# Altium schematic sheet ESS-BoB.SchDoc: ESS-BoB
size A3; DrawnBy: Guy Ovadia; Engineer: Guy Ovadia; Organization: TAMI Hackerspace; DocumentNumber: 1; Revision: REV_NOT_USED; SheetNumber: 1; SheetTotal: 1
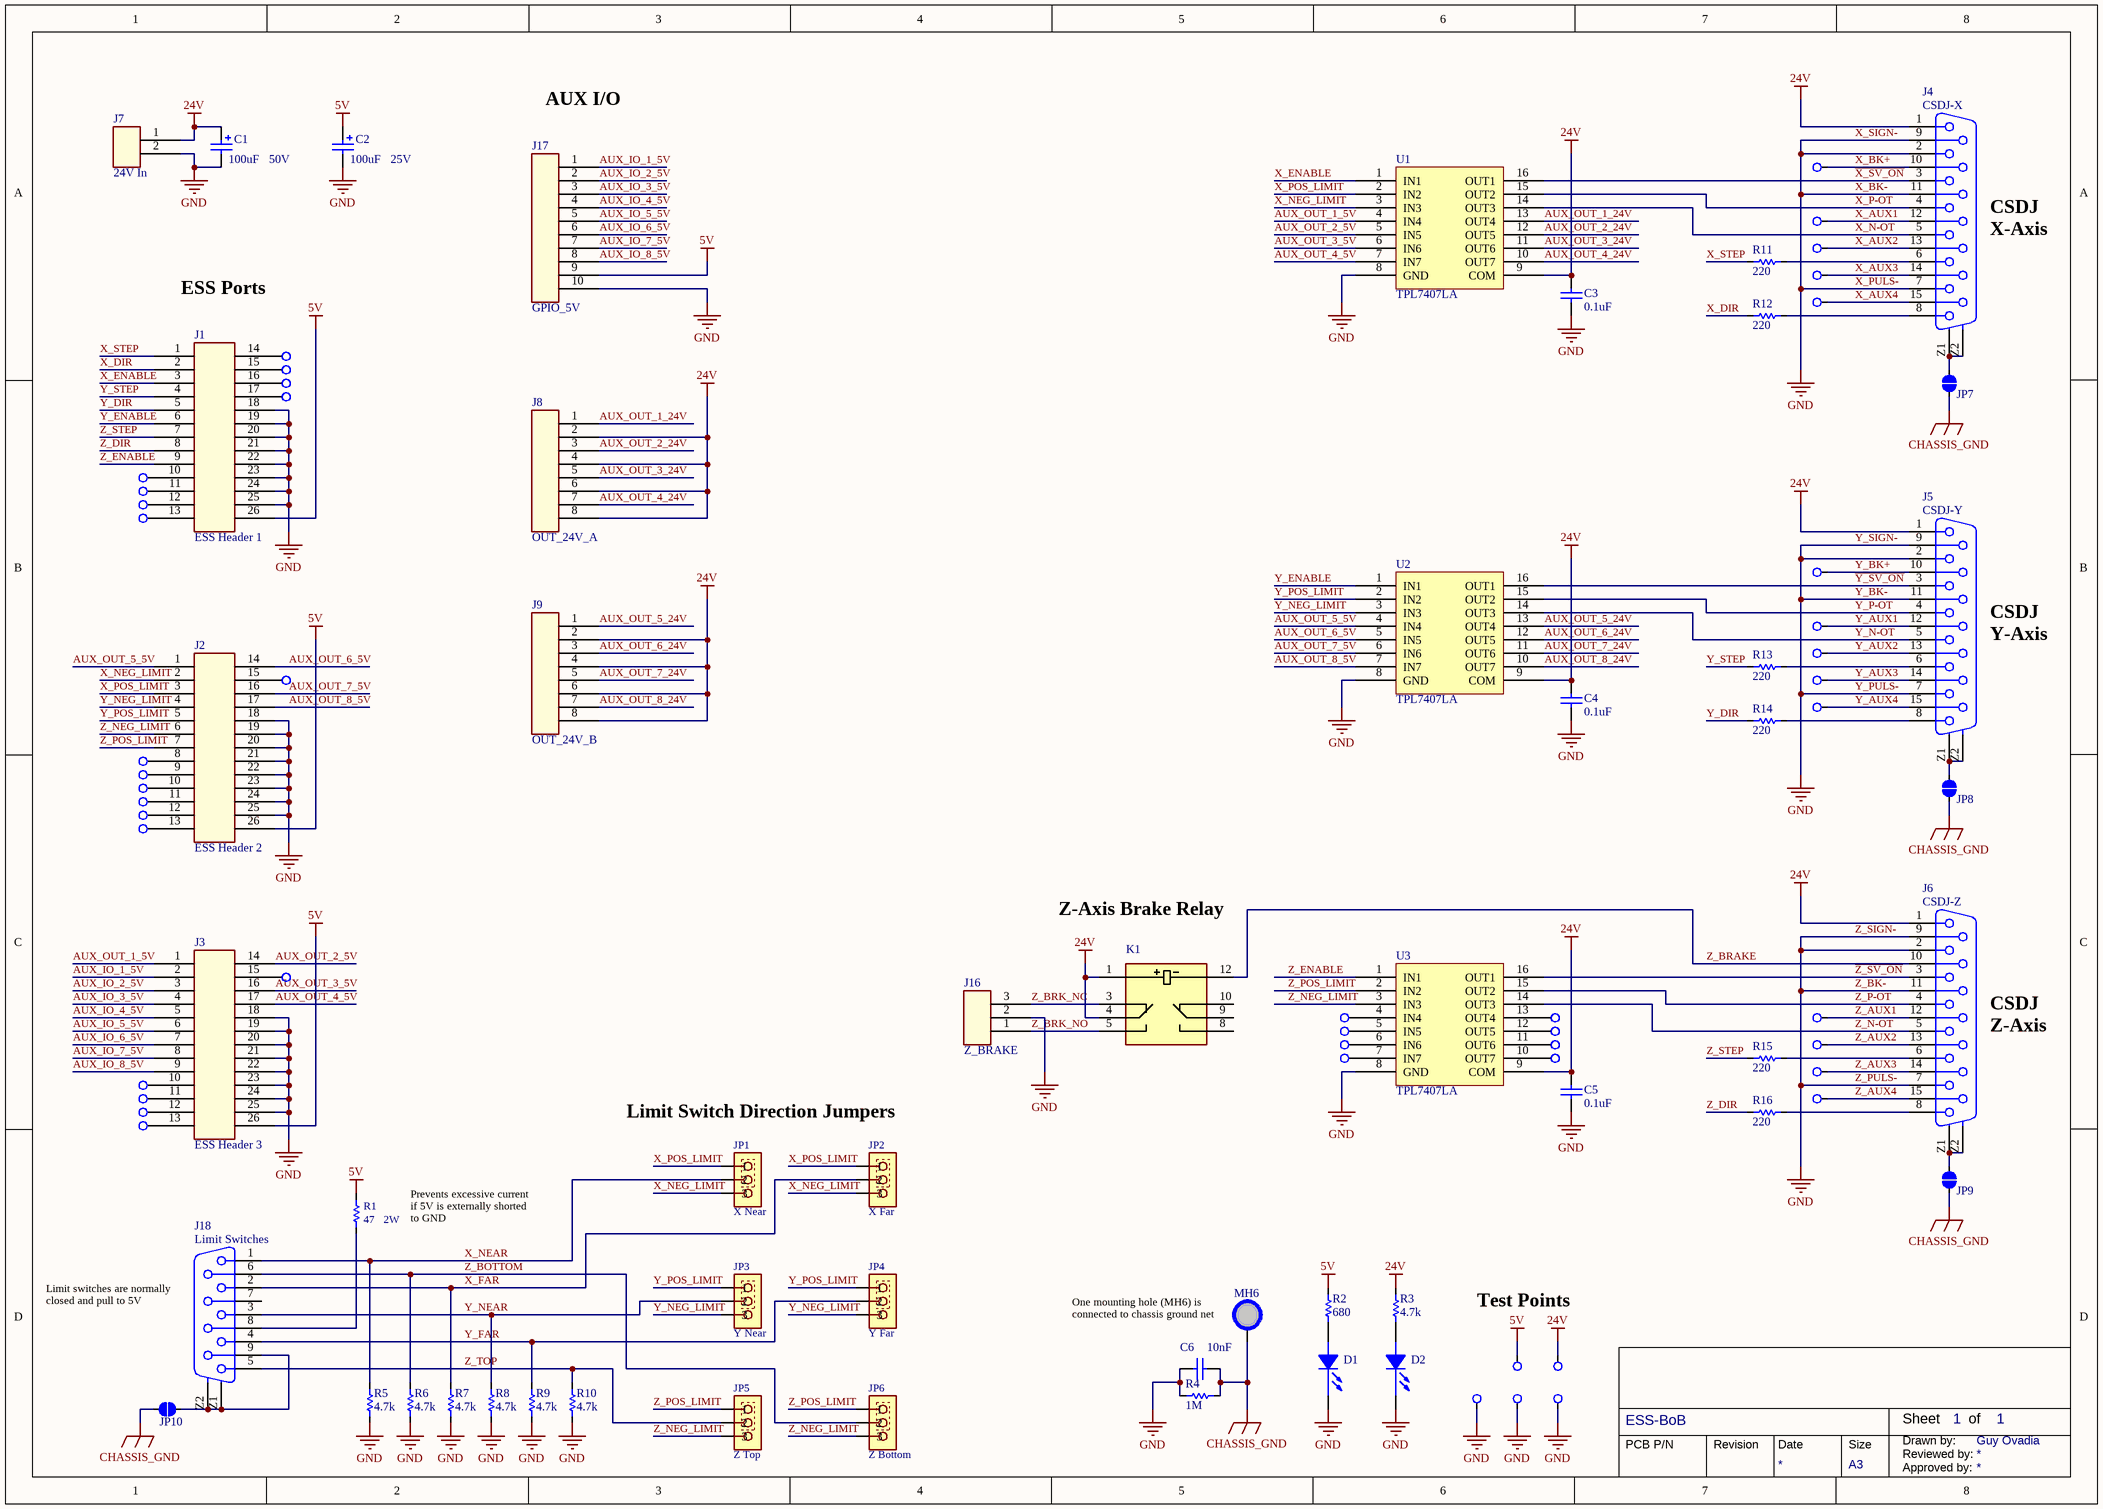
[diagram p0: ESS-BoB.SchDoc]

## Parts
C1  value 100uF  Voltage Rating: 50V  [CAPPR3.5-8x12]  (hidden comment: Cap Polarized)
C2  value 100uF  Voltage Rating: 25V  [CAPPR2-5x11]  (hidden comment: Cap Polarized)
C3  value 0.1uF  [CAPC2012N]  (hidden comment: Cap non-polarized)
C4  value 0.1uF  [CAPC2012N]  (hidden comment: Cap non-polarized)
C5  value 0.1uF  [CAPC2012N]  (hidden comment: Cap non-polarized)
C6  value 10nF  [CAPC2012N]  (hidden comment: Cap non-polarized)
D1  5V  [LED-3MM-RED]  (value not drawn)
D2  24V  [LED-3MM-RED]  (value not drawn)
J1  ESS Header 1  [Samtec ESQ-113-33-G-D]
J2  ESS Header 2  [Samtec ESQ-113-33-G-D]
J3  ESS Header 3  [Samtec ESQ-113-33-G-D]
J4  CSDJ-X  [D-SUB-15 FEMALE TH STRAIGHT]
J5  CSDJ-Y  [D-SUB-15 FEMALE TH STRAIGHT]
J6  CSDJ-Z  [D-SUB-15 FEMALE TH STRAIGHT]
J7  24V In  [Modular Screw Terminals 5.08mm 2p RA TH]
J8  OUT_24V_A  [Modular Screw Terminals 3.5mm 8p RA TH MOLEX]
J9  OUT_24V_B  [Modular Screw Terminals 3.5mm 8p RA TH MOLEX]
J16  Z_BRAKE  [Modular Screw Terminals 3.5mm 3p RA TH MOLEX]
J17  GPIO_5V  [Modular Screw Terminals 3.5mm 10p RA TH MOLEX]
J18  Limit Switches  [D-SUB-9 FEMALE TH RA]
JP1  X Near  [Header 2.54mm 3p TH Vertical]
JP2  X Far  [Header 2.54mm 3p TH Vertical]
JP3  Y Near  [Header 2.54mm 3p TH Vertical]
JP4  Y Far  [Header 2.54mm 3p TH Vertical]
JP5  Z Top  [Header 2.54mm 3p TH Vertical]
JP6  Z Bottom  [Header 2.54mm 3p TH Vertical]
JP7  Solder Jumper NO  [SOLDER JUMPER NO 1.6mm]  (value not drawn)  (no BOM)
JP8  Solder Jumper NO  [SOLDER JUMPER NO 1.6mm]  (value not drawn)  (no BOM)
JP9  Solder Jumper NO  [SOLDER JUMPER NO 1.6mm]  (value not drawn)  (no BOM)
JP10  Solder Jumper NO  [SOLDER JUMPER NO 1.6mm]  (value not drawn)  (no BOM)
K1  V23079A1001B301 _1393788-3_  [TE_RELAY_V23079_TH]  (value not drawn)
MH6  Mounting Hole  [HOLE M4]  (value not drawn)  (no BOM)
R1  value 47  Power (Watts): 2W  [RESC6332N]  (hidden comment: Resistor)
R2  value 680  [RESC2012N]  (hidden comment: Resistor)
R3  value 4.7k  [RESC2012N]  (hidden comment: Resistor)
R4  value 1M  [RESC2012N]  (hidden comment: Resistor)
R5  value 4.7k  [RESC2012N]  (hidden comment: Resistor)
R6  value 4.7k  [RESC2012N]  (hidden comment: Resistor)
R7  value 4.7k  [RESC2012N]  (hidden comment: Resistor)
R8  value 4.7k  [RESC2012N]  (hidden comment: Resistor)
R9  value 4.7k  [RESC2012N]  (hidden comment: Resistor)
R10  value 4.7k  [RESC2012N]  (hidden comment: Resistor)
R11  value 220  [RESC2012N]  (hidden comment: Resistor)
R12  value 220  [RESC2012N]  (hidden comment: Resistor)
R13  value 220  [RESC2012N]  (hidden comment: Resistor)
R14  value 220  [RESC2012N]  (hidden comment: Resistor)
R15  value 220  [RESC2012N]  (hidden comment: Resistor)
R16  value 220  [RESC2012N]  (hidden comment: Resistor)
TP1  (no value)  [TEST PAD TH]  (no BOM)
TP2  (no value)  [TEST PAD TH]  (no BOM)
TP3  (no value)  [TEST PAD TH]  (no BOM)
TP4  (no value)  [TEST PAD TH]  (no BOM)
TP5  (no value)  [TEST PAD TH]  (no BOM)
TP6  (no value)  [TEST PAD TH]  (no BOM)
TP7  (no value)  [TEST PAD TH]  (no BOM)
TP8  (no value)  [TEST PAD TH]  (no BOM)
TP9  (no value)  [TEST PAD TH]  (no BOM)
TP10  (no value)  [TEST PAD TH]  (no BOM)
TP11  (no value)  [TEST PAD TH]  (no BOM)
TP12  (no value)  [TEST PAD TH]  (no BOM)
TP13  (no value)  [TEST PAD TH]  (no BOM)
TP14  (no value)  [TEST PAD TH]  (no BOM)
TP15  (no value)  [TEST PAD TH]  (no BOM)
TP16  (no value)  [TEST PAD TH]  (no BOM)
TP17  (no value)  [TEST PAD TH]  (no BOM)
TP18  (no value)  [TEST PAD TH]  (no BOM)
TP19  (no value)  [TEST PAD TH]  (no BOM)
TP20  (no value)  [TEST PAD TH]  (no BOM)
TP21  (no value)  [TEST PAD TH]  (no BOM)
TP22  (no value)  [TEST PAD TH]  (no BOM)
TP23  (no value)  [TEST PAD TH]  (no BOM)
TP24  (no value)  [TEST PAD TH]  (no BOM)
TP25  (no value)  [TEST PAD TH]  (no BOM)
TP26  (no value)  [TEST PAD TH]  (no BOM)
TP27  (no value)  [TEST PAD TH]  (no BOM)
TP28  (no value)  [TEST PAD TH]  (no BOM)
TP29  (no value)  [TEST PAD TH]  (no BOM)
TP30  (no value)  [TEST PAD TH]  (no BOM)
TP31  (no value)  [TEST PAD TH]  (no BOM)
TP32  (no value)  [TEST PAD TH]  (no BOM)
TP33  (no value)  [TEST PAD TH]  (no BOM)
TP34  (no value)  [TEST PAD TH]  (no BOM)
TP35  (no value)  [TEST PAD TH]  (no BOM)
TP36  (no value)  [TEST PAD TH]  (no BOM)
TP37  (no value)  [TEST PAD TH]  (no BOM)
TP38  (no value)  [TEST PAD TH]  (no BOM)
TP39  (no value)  [TEST PAD TH]  (no BOM)
TP40  (no value)  [TEST PAD TH]  (no BOM)
TP41  (no value)  [TEST PAD TH]  (no BOM)
TP42  (no value)  [TEST PAD TH]  (no BOM)
TP43  5V  [TP_LOOP_1MM - WHITE]  (value not drawn)
TP44  24V  [TP_LOOP_1MM - WHITE]  (value not drawn)
TP45  GND  [TP_LOOP_1MM - BLACK]  (value not drawn)
TP46  GND  [TP_LOOP_1MM - BLACK]  (value not drawn)
TP47  GND  [TP_LOOP_1MM - BLACK]  (value not drawn)
U1  TPL7407LA  [TI D016_M (SOIC16)]
U2  TPL7407LA  [TI D016_M (SOIC16)]
U3  TPL7407LA  [TI D016_M (SOIC16)]

## Nets
5V: C2.1 J1.26 J2.26 J3.26 J17.9 R1.2 R2.2 TP43.1(TP)
24V: C1.1 C3.2 C4.2 C5.2 J4.1 J5.1 J6.1 J7.1 J8.2 J8.4 J8.6 J8.8 J9.2 J9.4 J9.6 J9.8 K1.1 K1.4 R3.2 TP44.1(TP) U1.9(COM) U2.9(COM) U3.9(COM)
CHASSIS_GND: C6.1 JP7.1 JP8.1 JP9.1 JP10.2 MH6.1(MH) R4.2
X_BK-: C1.2 C2.2 C3.1 C4.1 C5.1 C6.2 D1.K(CATHODE) D2.K(CATHODE) J1.18 J1.19 J1.20 J1.21 J1.22 J1.23 J1.24 J1.25 J2.18 J2.19 J2.20 J2.21 J2.22 J2.23 J2.24 J2.25 J3.18 J3.19 J3.20 J3.21 J3.22 J3.23 J3.24 J3.25 J4.2 J4.7 J4.9 J4.11 J5.2 J5.7 J5.9 J5.11 J6.2 J6.7 J6.9 J6.11 J7.2 J16.2 J17.10 R4.1 R5.1 R6.1 R7.1 R8.1 R9.1 R10.1 TP45.1(TP) TP46.1(TP) TP47.1(TP) U1.8(GND) U2.8(GND) U3.8(GND)  [also labelled GND, X_PULS-, X_SIGN-, Y_BK-, Y_PULS-, Y_SIGN-, Z_BK-, Z_PULS-, Z_SIGN-]
~{X_SV_ON}: J4.3 U1.16(OUT1)
~{Y_SV_ON}: J5.3 U2.16(OUT1)
~{Z_SV_ON}: J6.3 U3.16(OUT1)
AUX_IO_1_5V: J3.2 J17.1
AUX_IO_2_5V: J3.3 J17.2
AUX_IO_3_5V: J3.4 J17.3
AUX_IO_4_5V: J3.5 J17.4
AUX_IO_5_5V: J3.6 J17.5
AUX_IO_6_5V: J3.7 J17.6
AUX_IO_7_5V: J3.8 J17.7
AUX_IO_8_5V: J3.9 J17.8
AUX_OUT_1_5V: J3.1 U1.4(IN4)
AUX_OUT_1_24V: J8.1 U1.13(OUT4)
AUX_OUT_2_5V: J3.14 U1.5(IN5)
AUX_OUT_2_24V: J8.3 U1.12(OUT5)
AUX_OUT_3_5V: J3.16 U1.6(IN6)
AUX_OUT_3_24V: J8.5 U1.11(OUT6)
AUX_OUT_4_5V: J3.17 U1.7(IN7)
AUX_OUT_4_24V: J8.7 U1.10(OUT7)
AUX_OUT_5_5V: J2.1 U2.4(IN4)
AUX_OUT_5_24V: J9.1 U2.13(OUT4)
AUX_OUT_6_5V: J2.14 U2.5(IN5)
AUX_OUT_6_24V: J9.3 U2.12(OUT5)
AUX_OUT_7_5V: J2.16 U2.6(IN6)
AUX_OUT_7_24V: J9.5 U2.11(OUT6)
AUX_OUT_8_5V: J2.17 U2.7(IN7)
AUX_OUT_8_24V: J9.7 U2.10(OUT7)
X_AUX1: J4.12 TP2.1(TP)
X_AUX2: J4.13 TP3.1(TP)
X_AUX3: J4.14 TP4.1(TP)
X_AUX4: J4.15 TP5.1(TP)
X_BK+: J4.10 TP1.1(TP)
X_DIR: J1.2 R12.1
X_ENABLE: J1.3 U1.1(IN1)
X_FAR: J18.2 JP2.2 R7.2
X_N-OT: J4.5 U1.14(OUT3)
X_NEAR: J18.1 JP1.2 R5.2
X_NEG_LIMIT: J2.2 JP1.3 JP2.3 U1.3(IN3)
X_P-OT: J4.4 U1.15(OUT2)
X_POS_LIMIT: J2.3 JP1.1 JP2.1 U1.2(IN2)
X_STEP: J1.1 R11.1
Y_AUX1: J5.12 TP15.1(TP)
Y_AUX2: J5.13 TP16.1(TP)
Y_AUX3: J5.14 TP18.1(TP)
Y_AUX4: J5.15 TP19.1(TP)
Y_BK+: J5.10 TP14.1(TP)
Y_DIR: J1.5 R14.1
Y_ENABLE: J1.6 U2.1(IN1)
Y_FAR: J18.4 JP4.2 R9.2
Y_N-OT: J5.5 U2.14(OUT3)
Y_NEAR: J18.3 JP3.2 R8.2
Y_NEG_LIMIT: J2.4 JP3.3 JP4.3 U2.3(IN3)
Y_P-OT: J5.4 U2.15(OUT2)
Y_POS_LIMIT: J2.5 JP3.1 JP4.1 U2.2(IN2)
Y_STEP: J1.4 R13.1
Z_AUX1: J6.12 TP29.1(TP)
Z_AUX2: J6.13 TP34.1(TP)
Z_AUX3: J6.14 TP37.1(TP)
Z_AUX4: J6.15 TP40.1(TP)
Z_BOTTOM: J18.6 JP6.2 R6.2
Z_BRAKE: J6.10 K1.12
Z_BRK_NC: J16.3 K1.3
Z_BRK_NO: J16.1 K1.5
Z_DIR: J1.8 R16.1
Z_ENABLE: J1.9 U3.1(IN1)
Z_N-OT: J6.5 U3.14(OUT3)
Z_NEG_LIMIT: J2.6 JP5.3 JP6.3 U3.3(IN3)
Z_P-OT: J6.4 U3.15(OUT2)
Z_POS_LIMIT: J2.7 JP5.1 JP6.1 U3.2(IN2)
Z_STEP: J1.7 R15.1
Z_TOP: J18.5 JP5.2 R10.2
NetD1_A: D1.A(ANODE) R2.1
NetD2_A: D2.A(ANODE) R3.1
NetJ1_10: J1.10 TP10.1(TP)
NetJ1_11: J1.11 TP11.1(TP)
NetJ1_12: J1.12 TP12.1(TP)
NetJ1_13: J1.13 TP13.1(TP)
NetJ1_14: J1.14 TP6.1(TP)
NetJ1_15: J1.15 TP7.1(TP)
NetJ1_16: J1.16 TP8.1(TP)
NetJ1_17: J1.17 TP9.1(TP)
NetJ2_8: J2.8 TP20.1(TP)
NetJ2_9: J2.9 TP21.1(TP)
NetJ2_10: J2.10 TP22.1(TP)
NetJ2_11: J2.11 TP23.1(TP)
NetJ2_12: J2.12 TP24.1(TP)
NetJ2_13: J2.13 TP25.1(TP)
NetJ2_15: J2.15 TP17.1(TP)
NetJ3_10: J3.10 TP38.1(TP)
NetJ3_11: J3.11 TP39.1(TP)
NetJ3_12: J3.12 TP41.1(TP)
NetJ3_13: J3.13 TP42.1(TP)
NetJ3_15: J3.15 TP26.1(TP)
NetJ4_6: J4.6 R11.2
NetJ4_8: J4.8 R12.2
NetJ4_Z1: J4.Z1(GND) J4.Z2(GND) JP7.2
NetJ5_6: J5.6 R13.2
NetJ5_8: J5.8 R14.2
NetJ5_Z1: J5.Z1(GND) J5.Z2(GND) JP8.2
NetJ6_6: J6.6 R15.2
NetJ6_8: J6.8 R16.2
NetJ6_Z1: J6.Z1(GND) J6.Z2(GND) JP9.2
NetJ18_8: J18.8 R1.1
NetJ18_9: J18.9 J18.Z1(GND) J18.Z2(GND) JP10.1
NetTP27_1: TP27.1(TP) U3.4(IN4)
NetTP28_1: TP28.1(TP) U3.13(OUT4)
NetTP30_1: TP30.1(TP) U3.5(IN5)
NetTP31_1: TP31.1(TP) U3.12(OUT5)
NetTP32_1: TP32.1(TP) U3.6(IN6)
NetTP33_1: TP33.1(TP) U3.11(OUT6)
NetTP35_1: TP35.1(TP) U3.7(IN7)
NetTP36_1: TP36.1(TP) U3.10(OUT7)

Not connected (* = marked no-connect by the designer): J18 7; K1 8 9 10

## Notes on the sheet
- (near J17) AUX I/O
- (near J4) CSDJ X-Axis
- ESS Ports
- (near J5) CSDJ Y-Axis
- (near K1) Z-Axis Brake Relay
- (near J6) CSDJ Z-Axis
- Limit Switch Direction Jumpers
- Prevents excessive current if 5V is externally shorted to GND
- (near J18) Limit switches are normally closed and pull to 5V
- One mounting hole (MH6) is connected to chassis ground net
- Test Points
- PCB P/N
- Revision
- Date
- Size
- Sheet
- Drawn by:
- Reviewed by:
- of
- A3
- Approved by:

## Library data of the parts
C1 C2 = Cap Polarized: Polarized Capacitor; Tolerance: TBD %; ESR: TBD mOhm
C3-C6 = Cap non-polarized: Capacitor, non-polarized; Tolerance: TBD %; Voltage Rating: TBD V; ESR: TBD mOhm
D1 D2 = LED
J1-J3 = CON2x13 Alt. Numbering: Manufacturer 1: Samtec Inc.; Manufacturer Part Number 1: ESQ-113-33-G-D; Description 1: ELEVATED SOCKET STRIPS; Category 1: Connectors, Interconnects; Connector Type: Elevated Socket; Style: Board to Board; Number of Positions: 26; Number of Positions Loaded: All; Pitch - Mating: 0.100" (2.54mm); Contact Length - Post: 0.090" (2.29mm); Material Flammability Rating: UL94 V-0; Current Rating: 5.7A per Contact; Voltage Rating: 550VAC; Supplier 1: Digi-Key; Supplier Part Number 1: SAM11103-ND; RoHS 1: RoHS Compliant; Pricing 1: 1=6.24, 10=5.28, 100=4.08, 500=3.36, 1000=3.12 (USD); Packaging: Tube; Part Status: Active; Contact Type: Forked; Row Spacing - Mating: 0.100" (2.54mm); Mounting Type: Through Hole; Termination: Solder; Fastening Type: Push-Pull; Contact Finish - Mating: Gold; Contact Finish Thickness - Mating: 20.0µin (0.51µm); Insulation Color: Black; Insulation Height: 0.635" (16.13mm); Operating Temperature: -55°C ~ 125°C; Contact Finish - Post: Gold; Mated Stacking Heights: -; Ingress Protection: -; Features: -; Applications: -; Insulation Material: Liquid Crystal Polymer (LCP); Contact Shape: Square; Contact Material: Phosphor Bronze; Contact Finish Thickness - Post: 3.00µin (0.076µm); ComponentLink1URL: http://suddendocs.samtec.com/prints/esq-1xx-xx-x-x-xxx-xx-x-xx-mkt.pdf; ComponentLink1Description: http://suddendocs.samtec.com/prints/esq-1xx-xx-x-x-xxx-xx-x-xx-mkt.pdf
J4-J6 = D-Sub-15 Wurth 618015231121: WR-DSUB Female Angled PCB Connector; pin to pad: Z1>M1 Z2>M2
J7 = CON2
J8 J9 = CON8
J16 = CON3
J17 = CON10
J18 = D-Sub-9 Wurth 618009231121: WR-DSUB Female Angled PCB Connector
JP1-JP6 = Jumper Header SPDT: Jumper Header - SPDT
K1 = RELAY_TE_ V23079: V23079A1001B301; MF: TE Connectivity; Contact_Switching_Voltage_Max: 250 VAC; Relay_Type: P2 Relay V23079; Product_Type: Relay; Package: DIP-8 TE Connectivity; MP: 1393788-3; Availability: Good; Price: 1.94 USD; SnapEDA_Link: https://www.snapeda.com/parts/1393788-3/TE%2520Connectivity/view-part/?ref=snap; Value: *
MH6 = Mounting Hole: Mounting Hole with electrical connection
R1 = Resistor: Manufacturer 1: Bourns Inc.; Manufacturer Part Number 1: CRM2512-JW-470ELF; Description 1: RES SMD 47 OHM 5% 2W 2512; Category 1: Resistors; Temperature Coefficient: ±200ppm/°C; Supplier 1: Digi-Key; Supplier Part Number 1: CRM2512-JW-470ELFCT-ND; RoHS 1: RoHS Compliant; Pricing 1: 1=0.39, 10=0.301, 25=0.2292, 50=0.1702, 100=0.1266, 250=0.10696, 500=0.09168, 1000=0.06985 (USD); Packaging: Cut Tape (CT); Part Status: Active; Composition: Thick Film; Features: Current Sense; Operating Temperature: -55°C ~ 155°C; Package / Case: 2512 (6432 Metric); Supplier Device Package: 2512; Size / Dimension: 0.248" L x 0.122" W (6.30mm x 3.10mm); Height - Seated (Max): 0.032" (0.80mm); Failure Rate: -; ComponentLink1URL: https://www.bourns.com/docs/Product-Datasheets/CRM.pdf; ComponentLink1Description: https://www.bourns.com/docs/Product-Datasheets/CRM.pdf
R2-R4 R11-R16 = Resistor: Tolerance: TBD%; Power Rating: TBD W
TP1-TP47 = TEST_POINT
U1-U3 = TPL7407L: Solenoid Driver